# Altium schematic sheet 03 Mobile Power.SchDoc: Beaglebone Mobicape
size C; Date: 12/9/2014; ApprovedBy: JSK; CheckedBy: JSK; Author: JKRO; CompanyName: University of Wisconsin; DrawnBy: JKRO; Engineer: JKRO; Organization: ECE 453; Address1: College of Engineering; Address2: 1415 Engineering Drive; Address3: Madison, WI 53706; Address4: ECE 453 Fall 2014; Revision: B; SheetNumber: 3; SheetTotal: 4; AssemblyNumber: CAPE F14; MachineName: BLACK; PCBNumber: MOBICAPE REV B; ApprovedDate: 12/9/2014
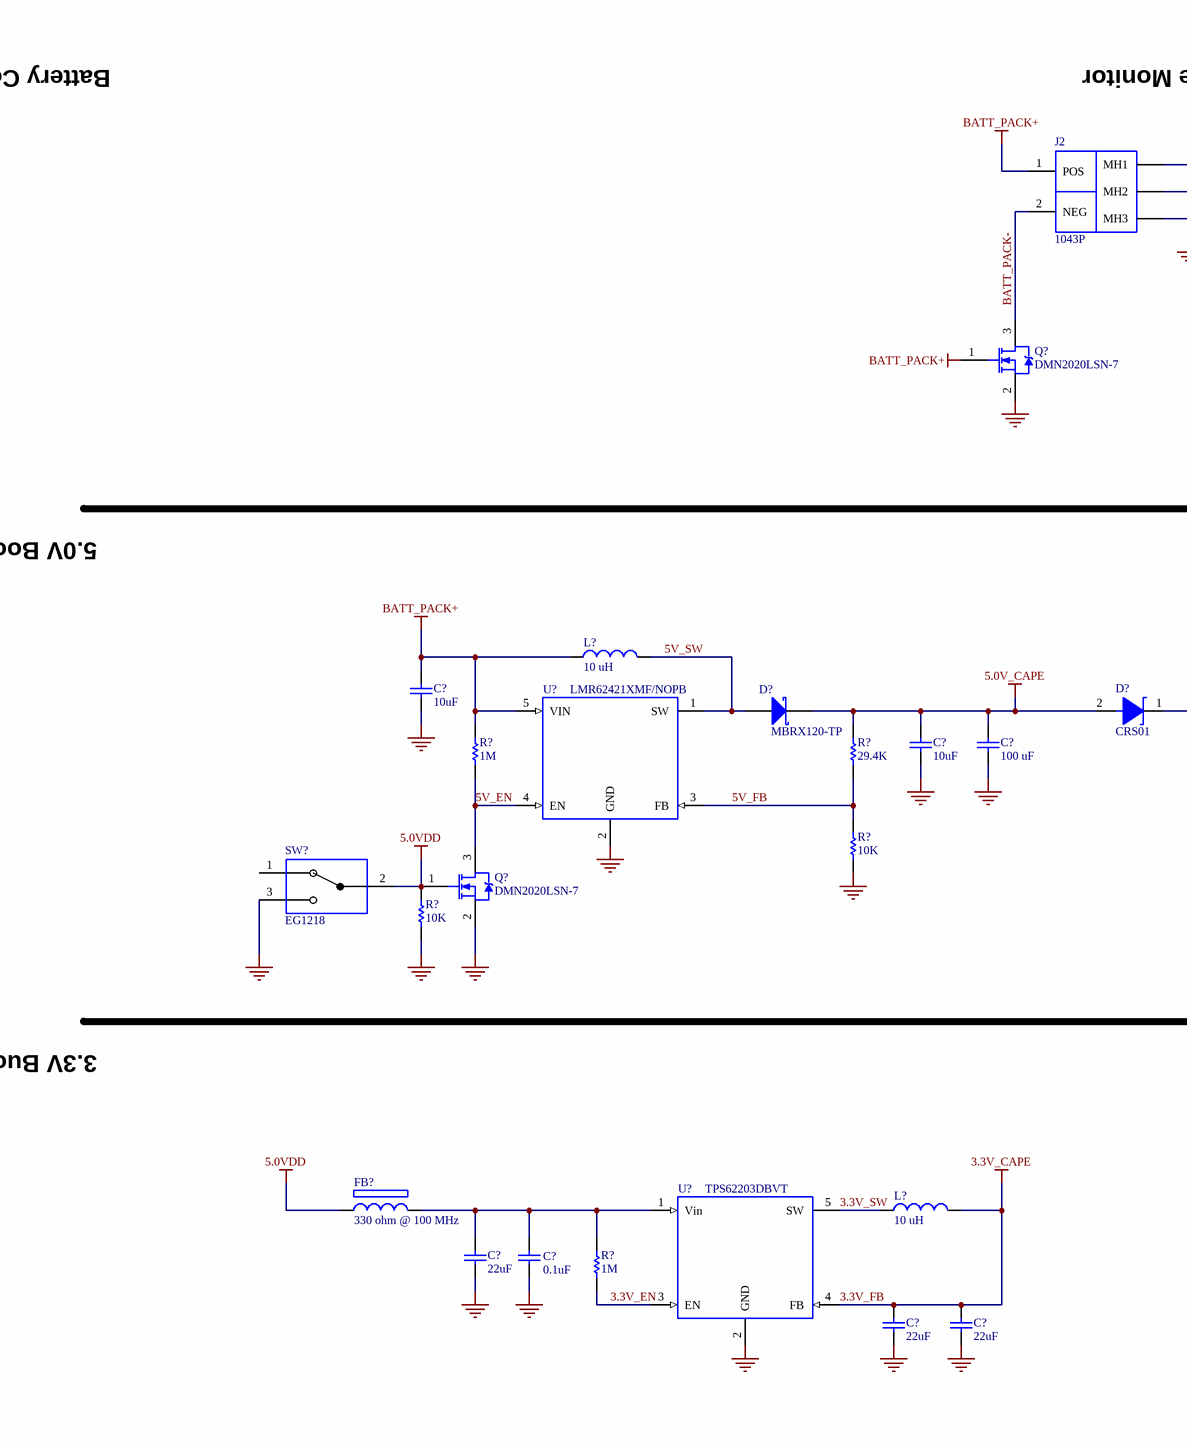
[diagram p0: 03 Mobile Power.SchDoc, left]
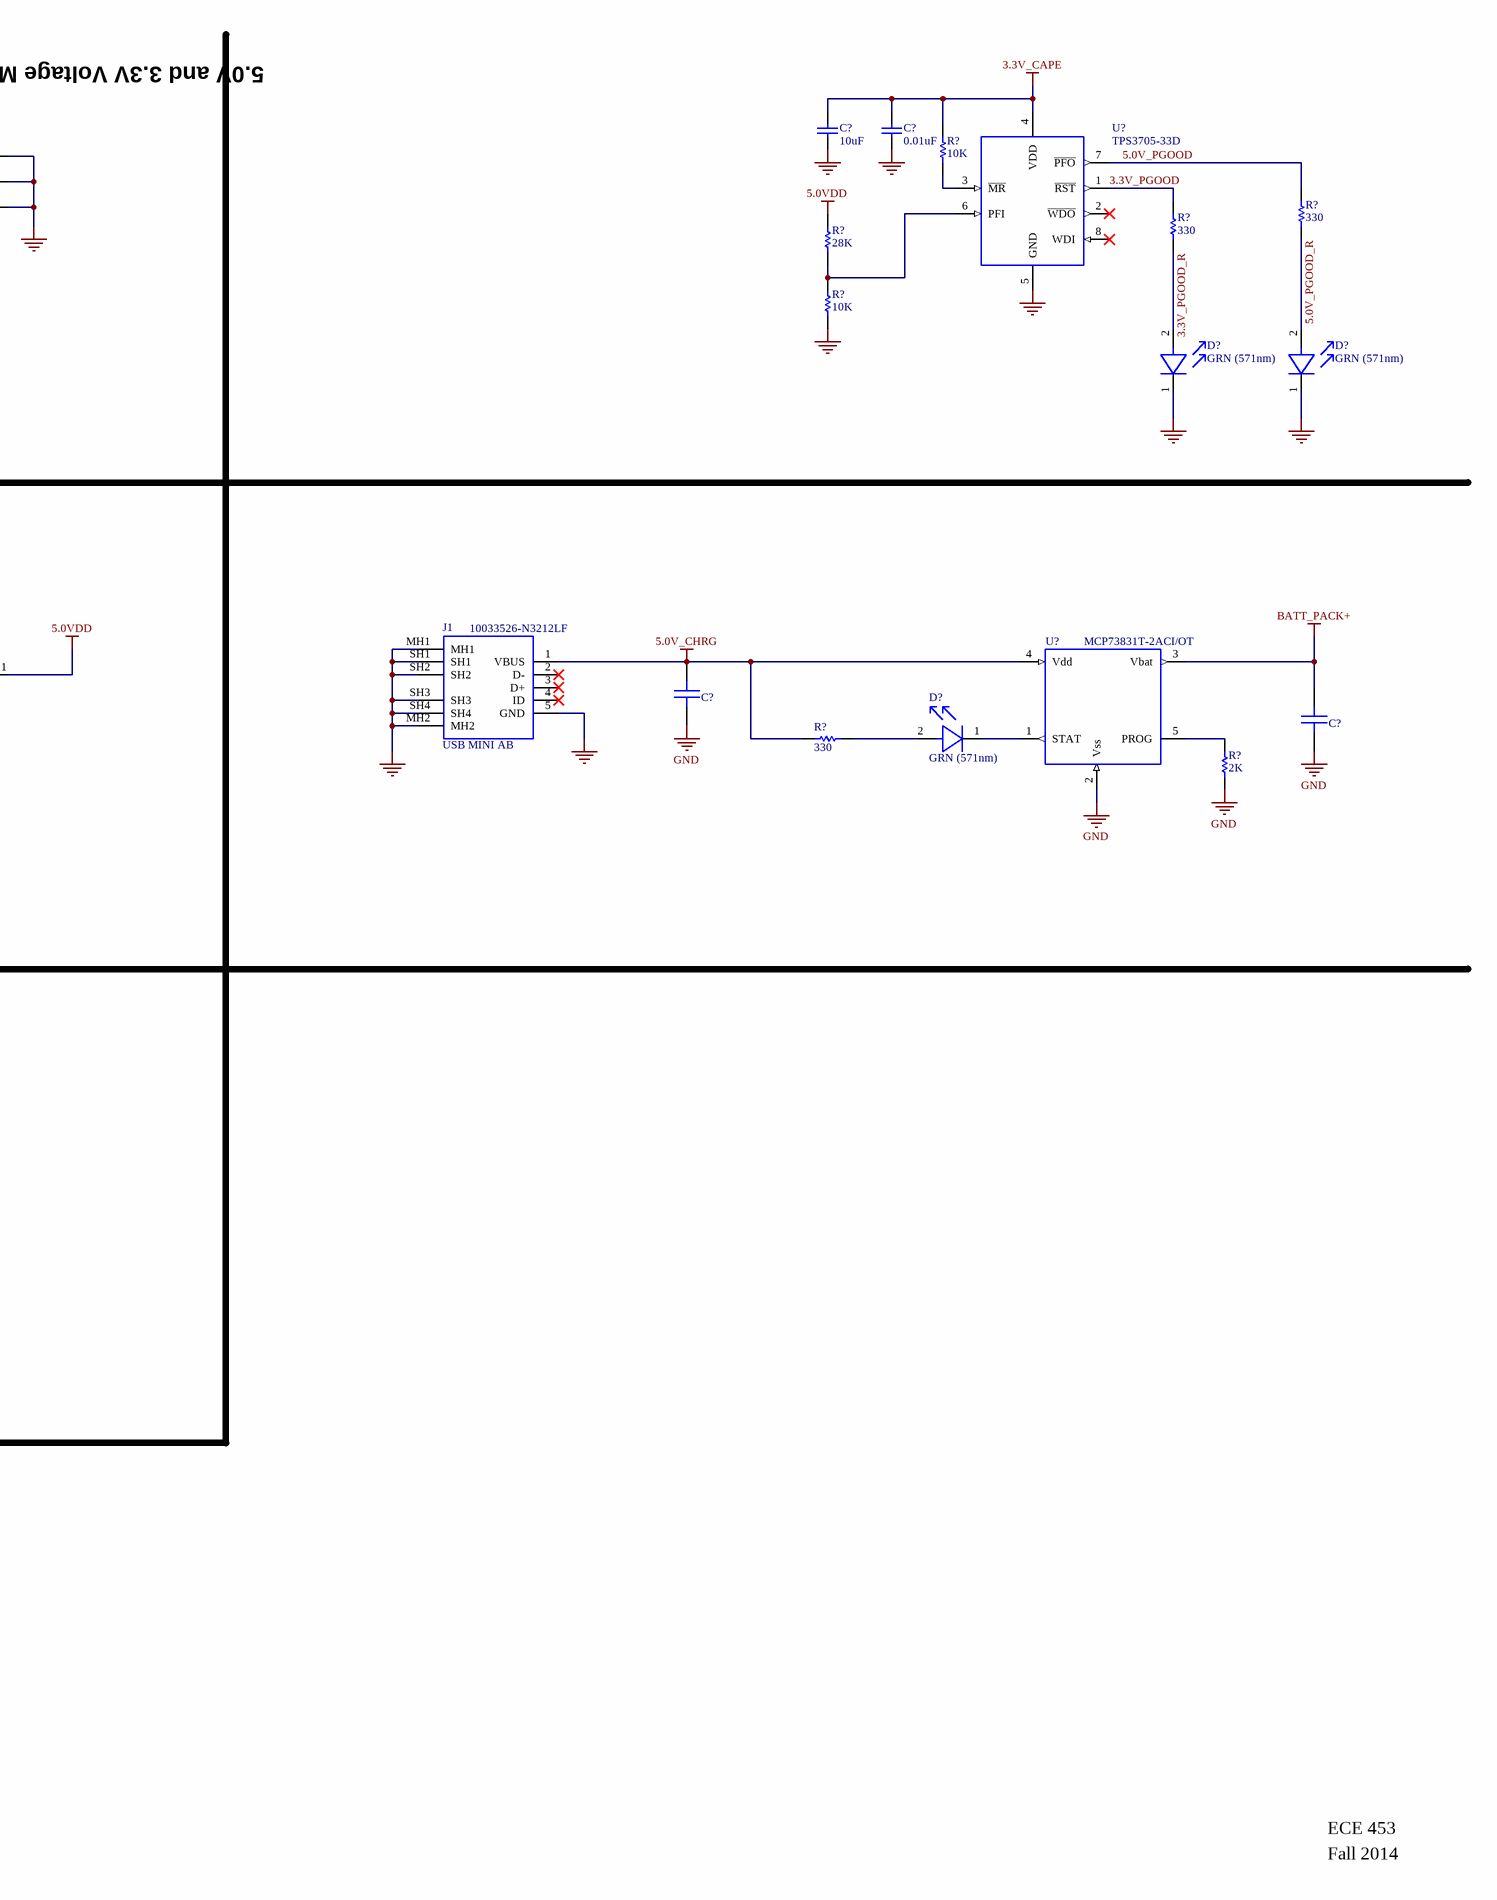
[diagram p1: 03 Mobile Power.SchDoc, right]

## Parts
(Parts that share a designator on the sheet are numbered #1, #2 ... from top to bottom, then left to right.)
C?#1  10uF  [CAP_0805]
C?#2  0.01uF  [CAP_0805]
C?#3  CAP_0805_U_004.70  [CAP_0805]  (value not drawn)
C?#4  10uF  [CAP_0805]
C?#5  CAP_0805_U_004.70  [CAP_0805]  (value not drawn)
C?#6  100 uF  [CAP_100uF]
C?#7  10uF  [CAP_0805]
C?#8  22uF  [CAP_0805]
C?#9  0.1uF  [CAP_0805]
C?#10  22uF  [CAP_0805]
C?#11  22uF  [CAP_0805]
D?#1  value GRN (571nm)  [LED_GRN_0805]  (hidden comment: LED_GREEN_0805.1)
D?#2  value GRN (571nm)  [LED_GRN_0805]  (hidden comment: LED_GREEN_0805.1)
D?#3  MBRX120-TP  [DIODE_MBRX120-TP]
D?#4  value CRS01  [SFLAT]  (hidden comment: DIODE_CRS01.1)
D?#5  value GRN (571nm)  [LED_GRN_0805]  (hidden comment: LED_GREEN_0805.1)
FB?  330 ohm @ 100 MHz  [FB_0805]
J1  value 10033526-N3212LF  Tolerance: USB MINI AB  [FCI_10033526-N3212LF]  (hidden comment: CONN_RECP_FCI_10033526-N3212LF.1)
J2  CONN_BAT_18650  [1043P]  (value not drawn)
L?#1  10 uH  [IND_10uH]
L?#2  10 uH  [IND_10uH]
Q?#1  Manufacturer Part Number: DMN2020LSN-7  [SOT23]  (hidden comment: IC_NMOS_DMN2020LSN)
Q?#2  Manufacturer Part Number: DMN2020LSN-7  [SOT23]  (hidden comment: IC_NMOS_DMN2020LSN)
R?#1  10K  [RES_0805]
R?#2  330  [RES_0805]
R?#3  330  [RES_0805]
R?#4  28K  [RES_0805]
R?#5  10K  [RES_0805]
R?#6  1M  [RES_0805]
R?#7  29.4K  [RES_0805]
R?#8  330  [RES_0805]
R?#9  2K  [RES_0805]
R?#10  10K  [RES_0805]
R?#11  10K  [RES_0805]
R?#12  1M  [RES_0805]
SW?  value EG1218  [EG1218]  (hidden comment: SWITCH_EG1218.1)
U?#1  Manufacturer Part Number: TPS3705-33D  [TPS3705]  (hidden comment: IC_TPS3705-33DGN.1)
U?#2  Manufacturer Part Number: MCP73831T-2ACI/OT  [SOT23-5BM]  (hidden comment: IC_MCP73831)
U?#3  Manufacturer Part Number: LMR62421XMF/NOPB  [SOT-23]  (hidden comment: LMR62421)
U?#4  TPS62203DBVT  [SOT23-5BM]

## Nets
3.3V_FB: C?#1.2 C?#2.2 C?#10.2 C?#11.2 L?#2.2 R?#1.2 U?#1.4(VDD) U?#4.4(FB)  [also labelled 3.3V_CAPE]
5.0V_CAPE: C?#6.2 C?#7.2 D?#3.2(K) D?#4.2(Anode) R?#7.2
5.0V_CHRG: C?#3.1 J1.1(VBUS) R?#8.2 U?#2.4(Vdd)
5.0VDD: D?#4.1(Cathode) FB?.1 Q?#2.1 R?#4.2 R?#11.2 SW?.2
BATT_PACK+: C?#4.2 C?#5.1 J2.1(POS) L?#1.1 Q?#1.1 R?#6.2 U?#2.3(Vbat) U?#3.5(VIN)
GND: C?#1.1 C?#2.1 C?#3.2 C?#4.1 C?#5.2 C?#6.1 C?#7.1 C?#8.1 C?#9.1 C?#10.1 C?#11.1 D?#1.1(Cathode) D?#2.1(Cathode) J1.5(GND) J1.MH1 J1.MH2 J1.SH1 J1.SH2 J1.SH3 J1.SH4 J2.MH1 J2.MH2 J2.MH3 Q?#1.2 Q?#2.2 R?#5.1 R?#9.1 R?#10.1 R?#11.1 SW?.3 U?#1.5(GND) U?#2.2(Vss) U?#3.2(GND) U?#4.2(GND)
3.3V_EN: R?#12.1 U?#4.3(EN)
3.3V_PGOOD: R?#3.2 U?#1.1(~{RST})
3.3V_PGOOD_R: D?#1.2(Anode) R?#3.1
3.3V_SW: L?#2.1 U?#4.5(SW)
5.0V_PGOOD: R?#2.2 U?#1.7(~{PFO})
5.0V_PGOOD_R: D?#2.2(Anode) R?#2.1
5V_EN: Q?#2.3 R?#6.1 U?#3.4(EN)
5V_FB: R?#7.1 R?#10.2 U?#3.3(FB)
5V_SW: D?#3.1(A) L?#1.2 U?#3.1(SW)
BATT_PACK-: J2.2(NEG) Q?#1.3
NetC?#8_2: C?#8.2 C?#9.2 FB?.2 R?#12.2 U?#4.1(Vin)
NetD?#5_1: D?#5.1(Cathode) U?#2.1(STAT)
NetD?#5_2: D?#5.2(Anode) R?#8.1
NetR?#1_1: R?#1.1 U?#1.3(~{MR})
NetR?#4_1: R?#4.1 R?#5.2 U?#1.6(PFI)
NetR?#9_2: R?#9.2 U?#2.5(PROG)

Not connected (* = marked no-connect by the designer): J1 2(D-)* 3(D+)* 4(ID)*; SW? 1; U?#1 2(~{WDO})* 8(WDI)*

## Notes on the sheet
- Battery Connector and Reverse Voltage Protection
- 5.0V and 3.3V Voltage Monitor
- 5.0V Boost Regulator
- 3.3V Buck Regulator
- ECE 453
- Fall 2014
- Title:
- Size:
- C
- Machine:
- P.C. Board No:
- College of Engineering
- Assembly No:
- Rev:
- Sheet:
- of
- 1415 Engineering Drive
- Madison, WI 53706

## Library data of the parts
C?#1 C?#4 C?#7 = CAP_0805_U_010.00: CAP CER 10 UF 6.3V 10% X7R 0805; Tolerance: +/-10%; Package: 0805; Rating: 6.3V; Supplier 1: Digi-Key; Supplier Part Number 1: 399-7412-1-ND; Value: 10UF
C?#2 = CAP_0805_U_000.01: CAP CER 10000PF 16V 10% X7R 0805; Tolerance: +/-10%; Package: 0805; Rating: 16V; Supplier 1: Digi-Key; Supplier Part Number 1: 399-7995-1-ND; Value: 10000PF
C?#3 C?#5 = CAP_0805_U_004.70: CAP CER 4.7UF 16V 10% X7R 0805; Manufacturer Part Number: EMK212B7475KG-T; Manufacturer: Taiyo Yuden; Capacitance: 4.7µF; Thickness (Max): 0.053" (1.35mm); Part Status: Active; Supplier: Digi-Key; Package / Case: 0805 (2012 Metric); Mounting Type: Surface Mount, MLCC; Height - Seated (Max): -; Ratings: -; Temperature Coefficient: X7R; Applications: General Purpose; Operating Temperature: -55°C ~ 125°C; Features: -; Lead Style: -; Category: Capacitors; Tolerance: ±10%; Voltage - Rated: 16V; Packaging: Cut Tape (CT); Size / Dimension: 0.079" L x 0.049" W (2.00mm x 1.25mm); RoHS: RoHS Compliant; Lead Spacing: -; Supplier Part Number: 587-2394-1-ND
C?#6 = CAP_100uF: Manufacturer: Nichicon; Manufacturer Part Number: UCD1V101MNL1GS; Capacitance: 100µF; Tolerance: ±20%; Voltage Rating: 35V; Lifetime @ Temp.: 5000 Hrs @ 105°C; Ripple Current: 600mA; Impedance: 160 mOhm; Surface Mount Land Size: 0.327" L x 0.327" W (8.30mm x 8.30mm); Supplier 1: Digi-Key; RoHS: RoHS Compliant; Category: Capacitors; Stock 1: 2915; Pricing 1: 1=0.57, 10=0.548, 25=0.3884, 50=0.3272, 100=0.2659, 250=0.22088 (USD); Packaging: Cut Tape (CT); ESR (Equivalent Series Resistance): -; Operating Temperature: -55°C ~ 105°C; Type: -; Applications: General Purpose; Lead Spacing: -; Size / Dimension: 0.315" Dia (8.00mm); Height - Seated (Max): 0.413" (10.50mm); Mounting Type: Surface Mount; Package / Case: Radial, Can - SMD; ComponentLink1URL: http://nichicon-us.com/english/products/pdfs/e-cd.pdf; ComponentLink1Description: http://nichicon-us.com/english/products/pdfs/e-cd.pdf; Supplier Part Number 1: 493-6186-1-ND
C?#8 C?#10 C?#11 = CAP_0805_U_022.00: Manufacturer Part Number: EMK212BBJ226MG-T; Manufacturer: Taiyo Yuden; Capacitance: 22µF; Voltage - Rated: 16V; Temperature Coefficient: X5R; Tolerance: ±20%; Ratings: -; Packaging: Cut Tape (CT); Features: -; Part Status: Active; Size / Dimension: 0.079" L x 0.039" W (2.00mm x 1.00mm); Category: Capacitors; Failure Rate: *; Thickness (Max): 0.049" (1.25mm); Applications: General Purpose; Lead Spacing: -; Lead Style: -; Height - Seated (Max): -; RoHS: RoHS Compliant; Mounting Type: Surface Mount, MLCC; Supplier: Digi-Key; Package / Case: 0805 (2012 Metric); Operating Temperature: -55°C ~ 85°C; Supplier Part Number: 587-3239-1-ND
C?#9 = CAP_0805_U_000.10: CAP CER 0.1UF 16V 10% X7R 0805; Tolerance: +/-10%; Package: 0805; Rating: 16V; Supplier 1: Digi-Key; Supplier Part Number 1: 399-1167-1-ND; Value: 0.1UF
D?#1 D?#2 D?#5 = LED_GREEN_0805.1: LED GREEN CLEAR THIN 0805 SMD; Rating: 20mA; Package: 0805; Tolerance: N/A; Supplier 1: Digi-Key; Supplier Part Number 1: 160-1426-1-ND
D?#3 = DIODE_LMR62421: Manufacturer: Micro Commercial Co; Diode Type: Schottky; Voltage - DC Reverse (Vr) (Max): 20V; Current - Average Rectified (Io): 1A; Voltage - Forward (Vf) (Max) @ If: 500mV @ 1A; Speed: Fast Recovery =< 500ns, > 200mA (Io); Current - Reverse Leakage @ Vr: 300µA @ 20V; Capacitance @ Vr, F: 30pF @ 4V, 1MHz; Supplier 1: Digi-Key; Manufacturer Part Number: MBRX120-TP; RoHS: RoHS Compliant; Category: Discrete Semiconductor Products; Stock 1: 96715; Pricing 1: 1=0.45, 10=0.324, 25=0.2524, 100=0.1911, 250=0.13512, 500=0.10816, 1000=0.08295 (USD); Packaging: Cut Tape (CT); Reverse Recovery Time (trr): -; Mounting Type: Surface Mount; Package / Case: SOD-123; Supplier Device Package: SOD-123; Operating Temperature - Junction: -55°C ~ 125°C; ComponentLink1URL: http://www.mccsemi.com/up_pdf/MBRX120-MBRX160(SOD123).pdf; ComponentLink1Description: http://www.mccsemi.com/up_pdf/MBRX120-MBRX160(SOD123).pdf; Supplier Part Number 1: MBRX120TPMSCT-ND
D?#4 = DIODE_CRS01.1: DIODE SCHOTTKY 30V 1A SFLAT; Rating: 1A, 30V; Package: SFLAT; Supplier 1: Digi-Key; Supplier Part Number 1: CRS01QCT-ND
FB? = FB 330 ohm @ 100 MHz: Manufacturer: TDK Corporation; Manufacturer Part Number: MPZ2012S331AT000; Current Rating: 2.5A; DC Resistance (DCR): 50 mOhm Max; Filter Type: Differential Mode - Single; Supplier 1: Digi-Key; RoHS: RoHS Compliant; Category: Filters; Stock 1: 154063; Pricing 1: 1=0.12, 10=0.101, 100=0.0574, 250=0.04528, 500=0.03824, 1000=0.03221 (USD); Packaging: Cut Tape (CT); Impedance @ Frequency: 330 Ohm @ 100MHz; Package / Case: 0805 (2012 Metric); Mounting Type: Surface Mount; Height (Max): 0.041" (1.05mm); Size / Dimension: 0.079" L x 0.049" W (2.00mm x 1.25mm); ComponentLink1URL: http://product.tdk.com/en/catalog/datasheets/beads_commercial_power_mpz_en.pdf; ComponentLink1Description: http://product.tdk.com/en/catalog/datasheets/beads_commercial_power_mpz_en.pdf; Supplier Part Number 1: 445-1569-1-ND
J1 = CONN_RECP_FCI_10033526-N3212LF.1: CONN MINI USB RCPT RA TYPE B SMD; Package: FCI_10033526-N3212LF; Supplier 1: Digi-Key; Supplier Part Number 1: 609-4700-1-ND
J2 = CONN_BAT_18650: HOLDER FOR 18650 BATTERY; Manufacturer: Keystone Electronics; Battery Type, Function: Cylindrical, Holder; Style: Holder (Open); Battery Cell Size: 18650; Number of Cells: 1; Category: Battery Products; Supplier: Digi-Key; RoHS: RoHS Compliant; Part Status: Active; Battery Series: -; Mounting Type: PCB, Through Hole; Termination Style: PC Pin; Height Above Board: 0.585" (14.86mm); Operating Temperature: -50°C ~ 145°C; Supplier Part Number: 36-1043P-ND; Manufacturer Part Number: 1043P
L?#1 L?#2 = IND_1206_U_010.00: Manufacturer: Abracon LLC; Manufacturer Part Number: AIML-1206-100K-T; Type: Multilayer; Material - Core: Ferrite; Inductance: 10µH; Tolerance: ±10%; Current Rating: 25mA; Shielding: Shielded; DC Resistance (DCR): 800 mOhm Max; Q @ Freq: 55 @ 2MHz; Frequency - Self Resonant: 28MHz; Frequency - Test: 2MHz; Supplier 1: Digi-Key; RoHS: RoHS Compliant; Category: Inductors, Coils, Chokes; Stock 1: 13131; Pricing 1: 1=0.21, 10=0.195, 25=0.1756, 50=0.1522, 100=0.1365, 250=0.12676, 500=0.117, 1000=0.1014 (USD); Packaging: Cut Tape (CT); Current - Saturation: -; Operating Temperature: -55°C ~ 125°C; Mounting Type: Surface Mount; Package / Case: 1206 (3216 Metric); Size / Dimension: 0.126" L x 0.063" W (3.20mm x 1.60mm); Height - Seated (Max): 0.055" (1.40mm); Supplier Device Package: 1206; ComponentLink1URL: http://www.abracon.com/Magnetics/chips/AIML-1206.pdf; ComponentLink1Description: http://www.abracon.com/Magnetics/chips/AIML-1206.pdf; Supplier Part Number 1: 535-11657-1-ND
Q?#1 Q?#2 = IC_NMOS_DMN2020LSN: Manufacturer: Diodes Incorporated; Current - Continuous Drain (Id) @ 25°C: 6.9A (Ta); Gate Charge (Qg) @ Vgs: 11.6nC @ 4.5V; Vgs(th) (Max) @ Id: 1.5V @ 250µA; Input Capacitance (Ciss) @ Vds: 1149pF @ 10V; Power Dissipation (Max): 610mW (Ta); Drain to Source Voltage (Vdss): 20V; Rds On (Max) @ Id, Vgs: 20 mOhm @ 9.4A, 4.5V; FET Type: N-Channel; Packaging: Cut Tape (CT); Supplier Device Package: SC-59-3; Technology: MOSFET (Metal Oxide); Part Status: Active; Mounting Type: Surface Mount; FET Feature: -; Package / Case: TO-236-3, SC-59, SOT-23-3; RoHS: RoHS Compliant; Operating Temperature: -55°C ~ 150°C (TJ); Supplier: Digi-Key; Category: Discrete Semiconductor Products; Supplier Part Number: DMN2020LSN-7DICT-ND
R?#1 R?#5 R?#10 R?#11 = RES_0805_K_010.00: RES SMD 10K OHM 1% 1/8W 0805; Manufacturer Part Number: ERJ-6ENF1002V; Manufacturer: Panasonic Electronic Components; Power (Watts): 0.125W, 1/8W; Temperature Coefficient: ±100ppm/°C; Part Status: Active; Supplier Device Package: 0805; Category: Resistors; Tolerance: ±1%; Package / Case: 0805 (2012 Metric); Number of Terminations: 2; RoHS: RoHS Compliant; Supplier: Digi-Key; Size / Dimension: 0.079" L x 0.049" W (2.00mm x 1.25mm); Failure Rate: -; Resistance (Ohms): 10k; Composition: Thick Film; Packaging: Cut Tape (CT); Features: Automotive AEC-Q200; Height - Seated (Max): 0.028" (0.70mm); Operating Temperature: -55°C ~ 155°C; Supplier Part Number: P10.0KCCT-ND
R?#2 R?#3 R?#8 = RES_0805_R_330.00: RES SMD 330 OHM 1% 1/8W 0805; Manufacturer: Panasonic Electronic Components; Manufacturer Part Number: ERJ-6GEYJ331V; Temperature Coefficient: ±200ppm/°C; Tolerance: ±5%; Power (Watts): 0.125W, 1/8W; Resistance (Ohms): 330; Features: Automotive AEC-Q200; Number of Terminations: 2; Composition: Thick Film; RoHS: RoHS Compliant; Part Status: Active; Packaging: Cut Tape (CT); Package / Case: 0805 (2012 Metric); Size / Dimension: 0.079" L x 0.049" W (2.00mm x 1.25mm); Operating Temperature: -55°C ~ 155°C; Height - Seated (Max): 0.028" (0.70mm); Supplier Device Package: 0805; Failure Rate: -; Supplier: Digi-Key; Category: Resistors; Supplier Part Number: P330ACT-ND
R?#4 = RES_0805_K_028.00: RES SMD 28.0K OHM 1% 1/8W 0805; Manufacturer Part Number: ERJ-6ENF2802V; Manufacturer: Panasonic Electronic Components; Power (Watts): 0.125W, 1/8W; Temperature Coefficient: ±100ppm/°C; Number of Terminations: 2; Package / Case: 0805 (2012 Metric); Operating Temperature: -55°C ~ 155°C; Features: Automotive AEC-Q200; Failure Rate: -; Packaging: Cut Tape (CT); Size / Dimension: 0.079" L x 0.049" W (2.00mm x 1.25mm); Resistance (Ohms): 28k; Composition: Thick Film; Supplier Device Package: 0805; Part Status: Active; Height - Seated (Max): 0.028" (0.70mm); Tolerance: ±1%; Supplier: Digi-Key; RoHS: RoHS Compliant; Category: Resistors; Supplier Part Number: P28.0KCCT-ND
R?#6 R?#12 = RES_0805_M_001.00: RES SMD 1MOHM 1% 1/8W 0805; Manufacturer Part Number: ERJ-6ENF1004V; Manufacturer: Panasonic Electronic Components; Temperature Coefficient: ±100ppm/°C; Power (Watts): 0.125W, 1/8W; Part Status: Active; Failure Rate: -; Height - Seated (Max): 0.028" (0.70mm); Supplier Device Package: 0805; Tolerance: ±1%; Packaging: Cut Tape (CT); Supplier: Digi-Key; Composition: Thick Film; Operating Temperature: -55°C ~ 155°C; Package / Case: 0805 (2012 Metric); Resistance (Ohms): 1M; RoHS: RoHS Compliant; Category: Resistors; Features: Automotive AEC-Q200; Size / Dimension: 0.079" L x 0.049" W (2.00mm x 1.25mm); Number of Terminations: 2; Supplier Part Number: P1.00MCCT-ND
R?#7 = RES_0805_K_029.40: RES SMD 29.4K OHM 1% 1/8W 0805; Manufacturer Part Number: ERJ-6ENF2942V; Manufacturer: Panasonic Electronic Components; Temperature Coefficient: ±100ppm/°C; Power (Watts): 0.125W, 1/8W; Features: Automotive AEC-Q200; Supplier: Digi-Key; Part Status: Active; Resistance (Ohms): 29.4k; Tolerance: ±1%; Failure Rate: -; Number of Terminations: 2; Height - Seated (Max): 0.028" (0.70mm); Package / Case: 0805 (2012 Metric); Packaging: Cut Tape (CT); Composition: Thick Film; Supplier Device Package: 0805; Category: Resistors; Size / Dimension: 0.079" L x 0.049" W (2.00mm x 1.25mm); RoHS: RoHS Compliant; Operating Temperature: -55°C ~ 155°C; Supplier Part Number: P29.4KCCT-ND
R?#9 = RES_0805_K_002.00: RES SMD 2K OHM 1% 1/8W 0805; Manufacturer Part Number: ERJ-6ENF2001V; Manufacturer: Panasonic Electronic Components; Temperature Coefficient: ±100ppm/°C; Power (Watts): 0.125W, 1/8W; Features: Automotive AEC-Q200; Packaging: Cut Tape (CT); Tolerance: ±1%; Category: Resistors; Operating Temperature: -55°C ~ 155°C; Failure Rate: -; Supplier Device Package: 0805; Size / Dimension: 0.079" L x 0.049" W (2.00mm x 1.25mm); Part Status: Active; Number of Terminations: 2; Supplier: Digi-Key; Resistance (Ohms): 2k; RoHS: RoHS Compliant; Package / Case: 0805 (2012 Metric); Height - Seated (Max): 0.028" (0.70mm); Composition: Thick Film; Supplier Part Number: P2.00KCCT-ND
SW? = SWITCH_EG1218.1: SWITCH SLIDE SPDT 30V,  2A PC MNT; Package: EG1218; Supplier 1: Digi-Key; Supplier Part Number 1: EG1903-ND
U?#1 = IC_TPS3705-33DGN.1: IC 2.93V PROCESSOR MONITOR 8MSOP; Manufacturer: Texas Instruments; Number of Voltages Monitored: 1; Reset Timeout: 140 ms Minimum; Reset: Active Low; Output: Push-Pull, Totem Pole; RoHS: RoHS Compliant; Part Status: Active; Supplier: Digi-Key; Type: Simple Reset/Power-On Reset; Category: Integrated Circuits (ICs); Packaging: Tube; Mounting Type: Surface Mount; Supplier Device Package: 8-SOIC; Operating Temperature: -40°C ~ 85°C (TA); Voltage - Threshold: 2.93V; Package / Case: 8-SOIC (0.154", 3.90mm Width); Supplier Part Number: 296-2623-5-ND
U?#2 = IC_MCP73831: IC CONTROLLR LI-ION 4.2V SOT23-5; Manufacturer: Microchip Technology; Voltage - Supply (Max): 6V; Fault Protection: Over Voltage; Programmable Features: Current; Number of Cells: 1; Current - Charging: Constant - Programmable; Charge Current - Max: 500mA; Battery Chemistry: Lithium-Ion/Polymer; Battery Pack Voltage: 4.2V; Category: Integrated Circuits (ICs); Part Status: Active; RoHS: RoHS Compliant; Packaging: Cut Tape (CT); Interface: -; Operating Temperature: -40°C ~ 85°C (TA); Supplier Device Package: SOT-23-5; Package / Case: SC-74A, SOT-753; Supplier: Digi-Key; Supplier Part Number: MCP73831T-2ACI/OTCT-ND
U?#3 = LMR62421: Boost, SEPIC Switching Regulator IC Positive Adjustable 2.7V 1 Output 2.1A (Switch) SC-74A, SOT-753; Manufacturer: Texas Instruments; Function: Step-Up, Step-Up/Step-Down; Number of Outputs: 1; Voltage - Input (Max): 5.5V; Voltage - Output (Max): 24V; Frequency - Switching: 1.6MHz; Synchronous Rectifier: No; Supplier 1: Digi-Key; RoHS: RoHS Compliant; Category: Integrated Circuits (ICs); Stock 1: 1872; Pricing 1: 1=2.15, 10=1.94, 25=1.68, 50=1.58, 100=1.56, 250=1.39, 500=1.18 (USD); Packaging: Cut Tape (CT); Output Configuration: Positive; Topology: Boost, SEPIC; Output Type: Adjustable; Voltage - Input (Min): 2.7V; Voltage - Output (Min/Fixed): 2.7V; Current - Output: 2.1A (Switch); Operating Temperature: -40°C ~ 125°C (TJ); Mounting Type: Surface Mount; Package / Case: SC-74A, SOT-753; Supplier Device Package: SOT-23-5; ComponentLink1URL: http://www.ti.com/lit/ds/symlink/lmr62421.pdf; ComponentLink1Description: http://www.ti.com/lit/ds/symlink/lmr62421.pdf; Supplier Part Number 1: 296-39047-1-ND
U?#4 = TPS62203DBVT: IC REG BUCK SYNC 3.3V SOT23-5; Manufacturer: Texas Instruments; Output Type: Fixed; Number of Outputs: 1; Voltage - Input: 2.5 V ~ 6 V; Frequency - Switching: 1MHz; Current - Output: 300mA; Synchronous Rectifier: Yes; Function: Step-Down; Output Configuration: Positive; Voltage - Input (Min): 2.5V; Voltage - Input (Max): 6V; Type: Step-Down (Buck); Supplier Part Number: 296-12719-1-ND; Supplier: Digi-Key; Voltage - Output: 3.3V; Operating Temperature: -40°C ~ 85°C; Package / Case: SC-74A, SOT-753; Value: TPS62203DBVT; Supplier 1: Digi-Key; RoHS: RoHS Compliant; Category: Integrated Circuits (ICs); Stock 1: 2233; Pricing 1: 1=1.91, 10=1.53, 100=1.22 (USD); Packaging: Cut Tape (CT); Topology: Buck; Voltage - Output (Min/Fixed): 3.3V; Voltage - Output (Max): -; Mounting Type: Surface Mount; Supplier Device Package: SOT-23-5; ComponentLink1URL: http://www.ti.com/lit/ds/symlink/tps62200.pdf; ComponentLink1Description: http://www.ti.com/lit/ds/symlink/tps62200.pdf; Supplier Part Number 1: 296-12719-1-ND; Manufacturer Part Number: TPS62203DBVT